# Altium schematic sheet HDMI.SchDoc
size C; SheetNumber: 6; SheetTotal: 9
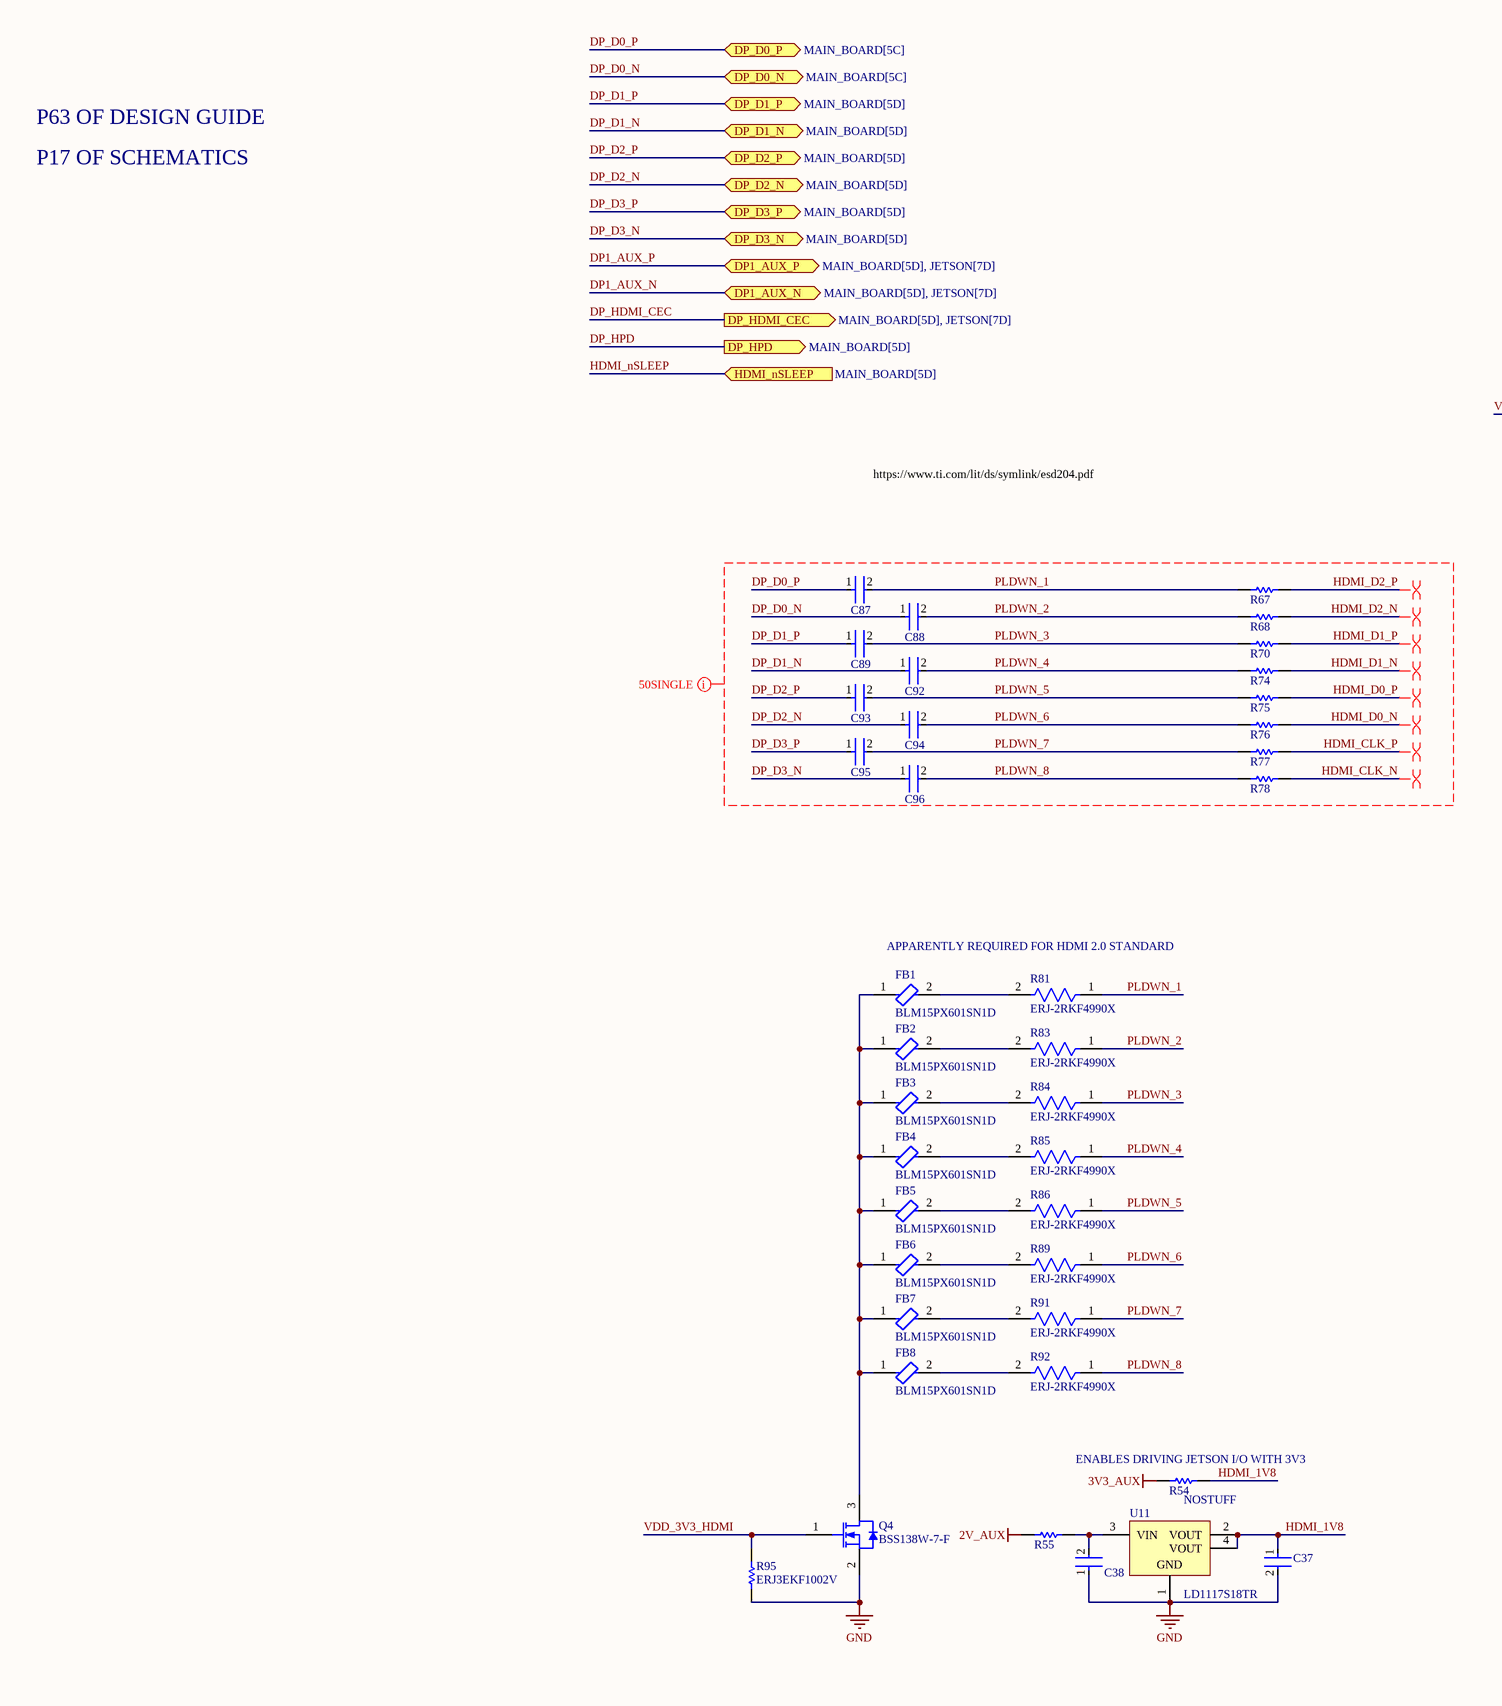
[diagram p0: HDMI.SchDoc, left]
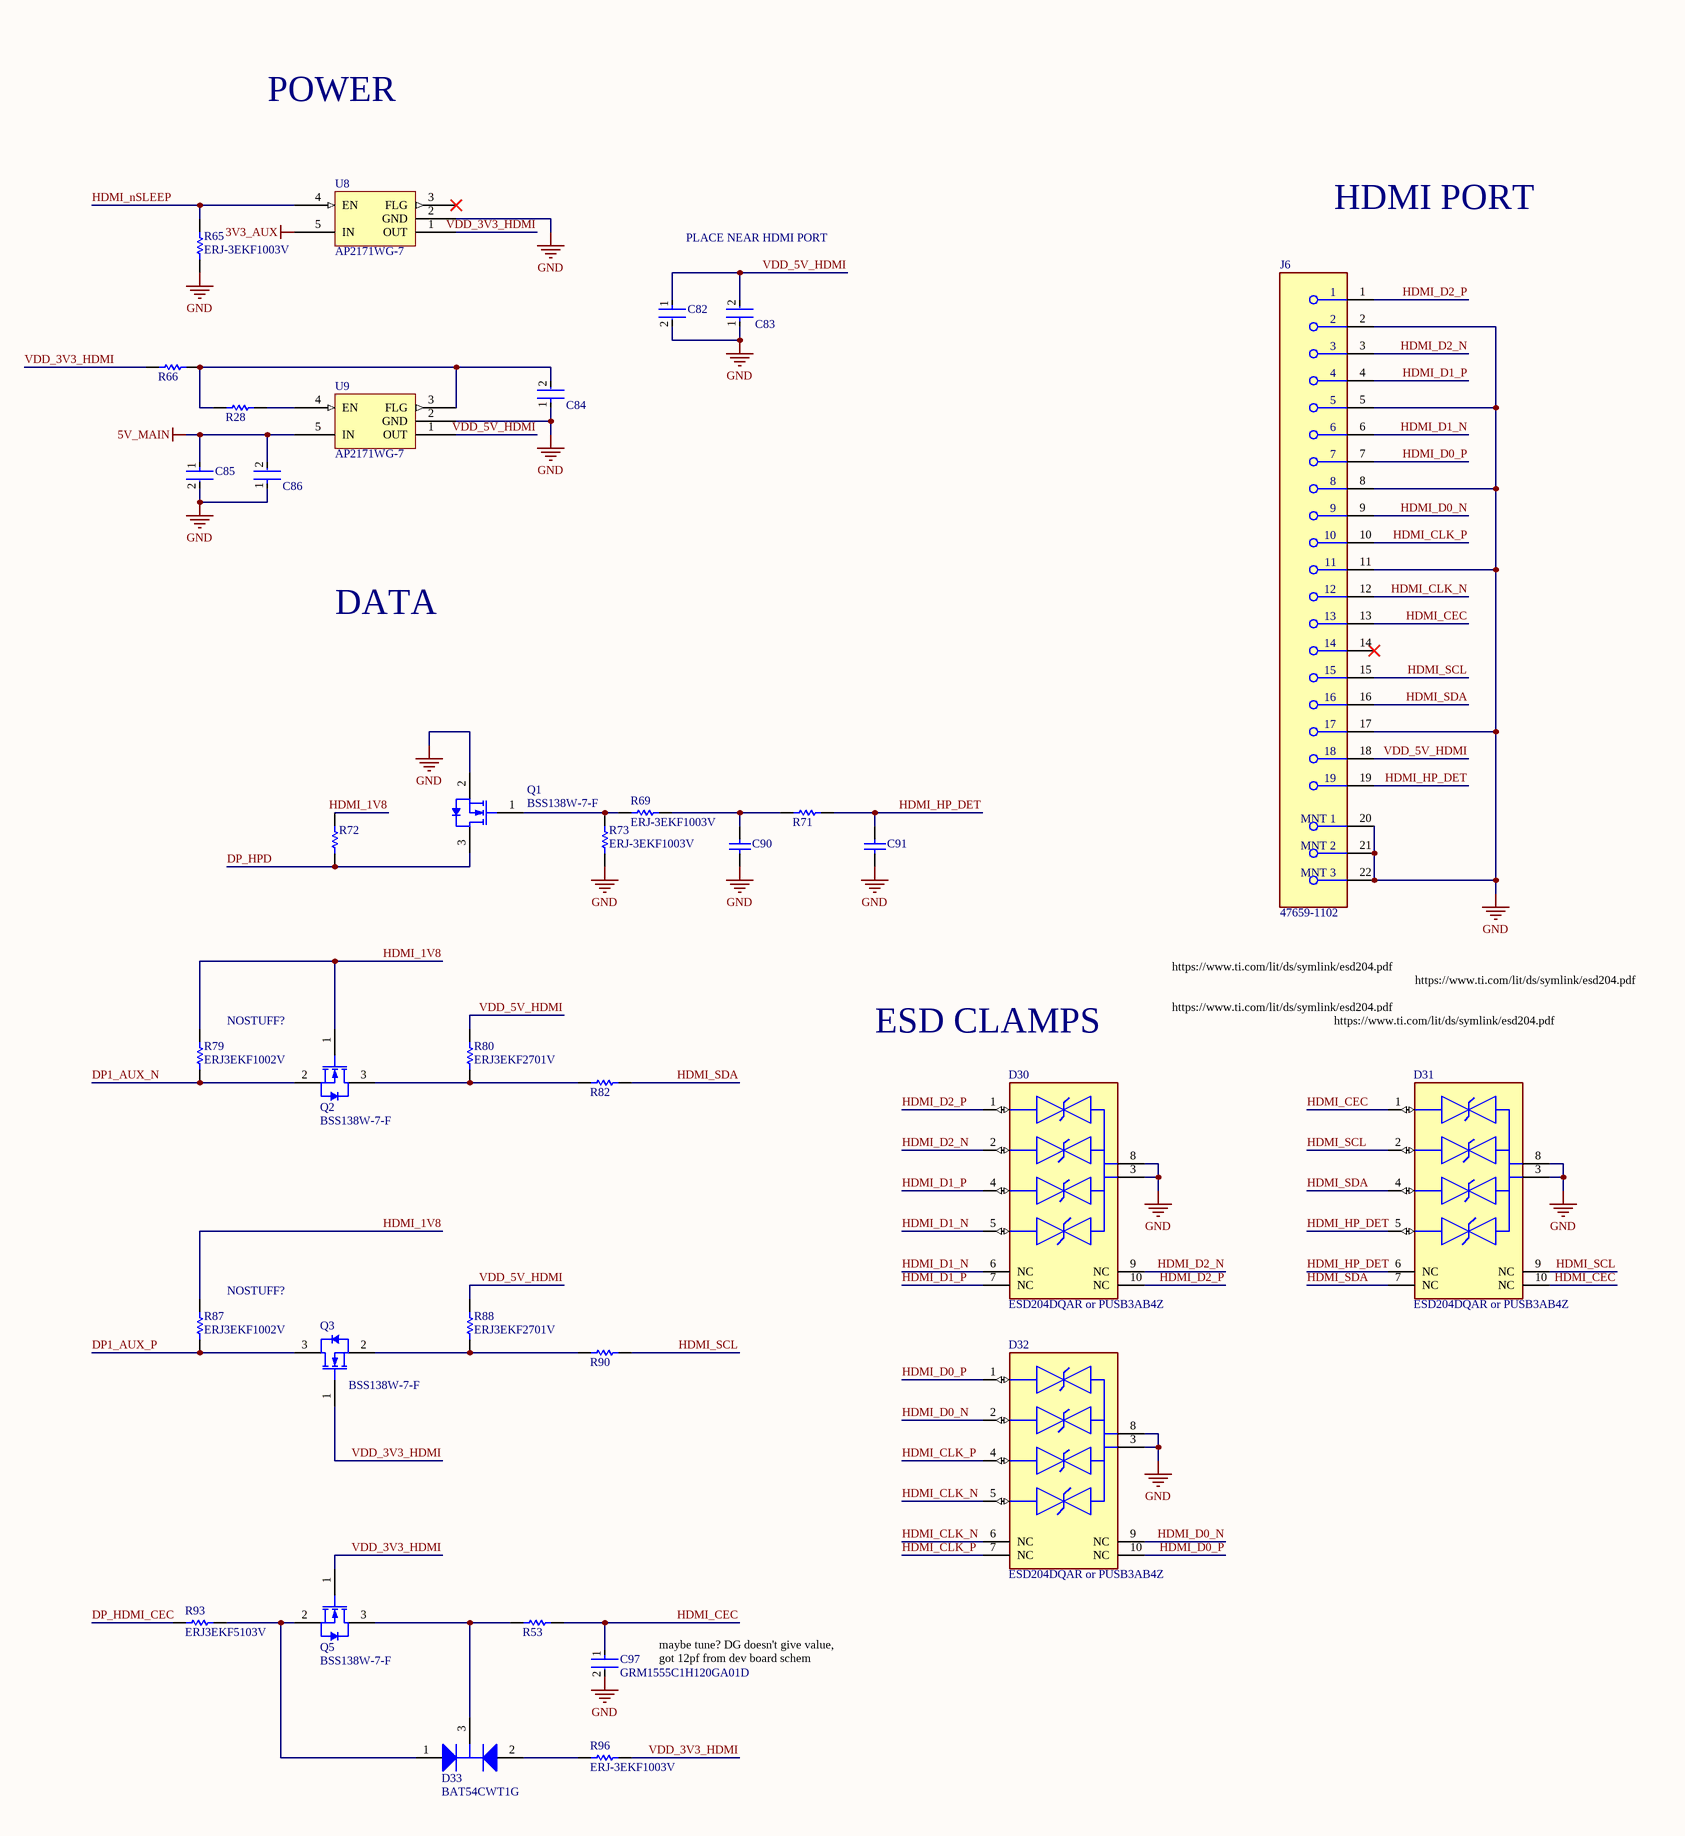
[diagram p1: HDMI.SchDoc, right]

## Parts
C37  GRM188R60J106ME47D  [FP-GRM188-0_1-e0_2_0_55-IPC_A]  (value not drawn)
C38  C1005X7R1H104K050BB  [FP-C1005-050-0_05-IPC_C]  (value not drawn)
C82  GRM188R60J106ME47D  [FP-GRM188-0_1-e0_2_0_55-IPC_A]  (value not drawn)
C83  C1005X7R1H104K050BB  [FP-C1005-050-0_05-IPC_C]  (value not drawn)
C84  C1005X7R1H104K050BB  [FP-C1005-050-0_05-IPC_C]  (value not drawn)
C85  GRM188R60J106ME47D  [FP-GRM188-0_1-e0_2_0_55-IPC_A]  (value not drawn)
C86  C1005X7R1H104K050BB  [FP-C1005-050-0_05-IPC_C]  (value not drawn)
C87  C1005X7R1H104K050BB  [FP-C1005-050-0_05-IPC_C]  (value not drawn)
C88  C1005X7R1H104K050BB  [FP-C1005-050-0_05-IPC_C]  (value not drawn)
C89  C1005X7R1H104K050BB  [FP-C1005-050-0_05-IPC_C]  (value not drawn)
C90  C0402C221K5RAC7867  [CAPC1005X60X30NL05T10]  (value not drawn)
C91  C0402C221K5RAC7867  [CAPC1005X60X30NL05T10]  (value not drawn)
C92  C1005X7R1H104K050BB  [FP-C1005-050-0_05-IPC_C]  (value not drawn)
C93  C1005X7R1H104K050BB  [FP-C1005-050-0_05-IPC_C]  (value not drawn)
C94  C1005X7R1H104K050BB  [FP-C1005-050-0_05-IPC_C]  (value not drawn)
C95  C1005X7R1H104K050BB  [FP-C1005-050-0_05-IPC_C]  (value not drawn)
C96  C1005X7R1H104K050BB  [FP-C1005-050-0_05-IPC_C]  (value not drawn)
C97  GRM1555C1H120GA01D  [FP-GRM155-0_05-MFG]
D30  ESD204DQAR or PUSB3AB4Z  [FP-DQA0010A-MFG]
D31  ESD204DQAR or PUSB3AB4Z  [FP-DQA0010A-MFG]
D32  ESD204DQAR or PUSB3AB4Z  [FP-DQA0010A-MFG]
D33  BAT54CWT1G  [ONSC-SOT-323-3-419-04_V]
FB1  BLM15PX601SN1D  [FP-BLM15-0_05-MFG]
FB2  BLM15PX601SN1D  [FP-BLM15-0_05-MFG]
FB3  BLM15PX601SN1D  [FP-BLM15-0_05-MFG]
FB4  BLM15PX601SN1D  [FP-BLM15-0_05-MFG]
FB5  BLM15PX601SN1D  [FP-BLM15-0_05-MFG]
FB6  BLM15PX601SN1D  [FP-BLM15-0_05-MFG]
FB7  BLM15PX601SN1D  [FP-BLM15-0_05-MFG]
FB8  BLM15PX601SN1D  [FP-BLM15-0_05-MFG]
J6  47659-1102  [FP-47659-1102-MFG]
Q1  BSS138W-7-F  [DIOD-SOT323-3_V]
Q2  BSS138W-7-F  [DIOD-SOT323-3_V]
Q3  BSS138W-7-F  [DIOD-SOT323-3_V]
Q4  BSS138W-7-F  [DIOD-SOT323-3_V]
Q5  BSS138W-7-F  [DIOD-SOT323-3_V]
R28  0402 JUMPER 0 OHM  [RESC1005X40X25NL05T05]  (value not drawn)
R53  0402 JUMPER 0 OHM  [RESC1005X40X25NL05T05]  (value not drawn)
R54  0402 JUMPER 0 OHM  [RESC1005X40X25NL05T05]  (value not drawn)
R55  0402 JUMPER 0 OHM  [RESC1005X40X25NL05T05]  (value not drawn)
R65  ERJ-3EKF1003V  [RESC1608X55X30ML15T15]
R66  ERJ3EKF1002V  [RESC1609X55X30LL15T15]  (value not drawn)
R67  0402 JUMPER 0 OHM  [RESC1005X40X25NL05T05]  (value not drawn)
R68  0402 JUMPER 0 OHM  [RESC1005X40X25NL05T05]  (value not drawn)
R69  ERJ-3EKF1003V  [RESC1608X55X30ML15T15]
R70  0402 JUMPER 0 OHM  [RESC1005X40X25NL05T05]  (value not drawn)
R71  0402 JUMPER 0 OHM  [RESC1005X40X25NL05T05]  (value not drawn)
R72  ERJ3EKF1002V  [RESC1609X55X30LL15T15]  (value not drawn)
R73  ERJ-3EKF1003V  [RESC1608X55X30ML15T15]
R74  0402 JUMPER 0 OHM  [RESC1005X40X25NL05T05]  (value not drawn)
R75  0402 JUMPER 0 OHM  [RESC1005X40X25NL05T05]  (value not drawn)
R76  0402 JUMPER 0 OHM  [RESC1005X40X25NL05T05]  (value not drawn)
R77  0402 JUMPER 0 OHM  [RESC1005X40X25NL05T05]  (value not drawn)
R78  0402 JUMPER 0 OHM  [RESC1005X40X25NL05T05]  (value not drawn)
R79  ERJ3EKF1002V  [RESC1609X55X30LL15T15]
R80  ERJ3EKF2701V  [RESC1608X55X30LL15T15]
R81  ERJ-2RKF4990X  [FP-ERJ2RK-MFG]
R82  0402 JUMPER 0 OHM  [RESC1005X40X25NL05T05]  (value not drawn)
R83  ERJ-2RKF4990X  [FP-ERJ2RK-MFG]
R84  ERJ-2RKF4990X  [FP-ERJ2RK-MFG]
R85  ERJ-2RKF4990X  [FP-ERJ2RK-MFG]
R86  ERJ-2RKF4990X  [FP-ERJ2RK-MFG]
R87  ERJ3EKF1002V  [RESC1609X55X30LL15T15]
R88  ERJ3EKF2701V  [RESC1608X55X30LL15T15]
R89  ERJ-2RKF4990X  [FP-ERJ2RK-MFG]
R90  0402 JUMPER 0 OHM  [RESC1005X40X25NL05T05]  (value not drawn)
R91  ERJ-2RKF4990X  [FP-ERJ2RK-MFG]
R92  ERJ-2RKF4990X  [FP-ERJ2RK-MFG]
R93  ERJ3EKF5103V  [RESC1608X55X30LL15T15]
R95  ERJ3EKF1002V  [RESC1609X55X30LL15T15]
R96  ERJ-3EKF1003V  [RESC1608X55X30ML15T15]
U8  AP2171WG-7  [SOT95P285X130-5N]
U9  AP2171WG-7  [SOT95P285X130-5N]
U11  LD1117S18TR  [SOT-223_M]

## Ports
DP1_AUX_N (bidir, see MAIN_BOARD[5D], JETSON[7D]), DP1_AUX_P (bidir, see MAIN_BOARD[5D], JETSON[7D]), DP_D0_N (bidir, see MAIN_BOARD[5C]), DP_D0_P (bidir, see MAIN_BOARD[5C]), DP_D1_N (bidir, see MAIN_BOARD[5D]), DP_D1_P (bidir, see MAIN_BOARD[5D]), DP_D2_N (bidir, see MAIN_BOARD[5D]), DP_D2_P (bidir, see MAIN_BOARD[5D]), DP_D3_N (bidir, see MAIN_BOARD[5D]), DP_D3_P (bidir, see MAIN_BOARD[5D]), DP_HDMI_CEC (out, see MAIN_BOARD[5D], JETSON[7D]), DP_HPD (out, see MAIN_BOARD[5D]), HDMI_nSLEEP (in, see MAIN_BOARD[5D])

## Nets
2V_AUX: R55.1
3V3_AUX: R54.1 U8.5(IN)
5V_MAIN: C85.1 C86.2 U9.5(IN)
GND: C37.2 C38.1 C82.2 C83.1 C84.1 C85.2 C86.1 C90.1 C91.1 C97.2 D30.3(GND) D30.8(GND) D31.3(GND) D31.8(GND) D32.3(GND) D32.8(GND) J6.2 J6.5 J6.8 J6.11 J6.17 J6.20(MNT_1) J6.21(MNT_2) J6.22(MNT_3) Q1.2(S) Q4.2(S) R65.1 R73.1 R95.1 U8.2(GND) U9.2(GND) U11.1(GND)
DP1_AUX_N: Q2.2(S) R79.1 ; port DP1_AUX_N
DP1_AUX_P: Q3.3(D) R87.1 ; port DP1_AUX_P
DP_D0_N: C88.1 ; port DP_D0_N
DP_D0_P: C87.1 ; port DP_D0_P
DP_D1_N: C92.1 ; port DP_D1_N
DP_D1_P: C89.1 ; port DP_D1_P
DP_D2_N: C94.1 ; port DP_D2_N
DP_D2_P: C93.1 ; port DP_D2_P
DP_D3_N: C96.1 ; port DP_D3_N
DP_D3_P: C95.1 ; port DP_D3_P
DP_HDMI_CEC: R93.1 ; port DP_HDMI_CEC
DP_HPD: Q1.3(D) R72.1 ; port DP_HPD
HDMI_1V8: C37.1 Q2.1(G) R54.2 R72.2 R79.2 R87.2 U11.2(VOUT) U11.4(VOUT)
HDMI_CEC: C97.1 D31.1(IO1) D31.10(NC) J6.13 R53.2
HDMI_CLK_N: D32.5(IO4) D32.6(NC) J6.12 R78.2
HDMI_CLK_P: D32.4(IO3) D32.7(NC) J6.10 R77.2
HDMI_D0_N: D32.2(IO2) D32.9(NC) J6.9 R76.2
HDMI_D0_P: D32.1(IO1) D32.10(NC) J6.7 R75.2
HDMI_D1_N: D30.5(IO4) D30.6(NC) J6.6 R74.2
HDMI_D1_P: D30.4(IO3) D30.7(NC) J6.4 R70.2
HDMI_D2_N: D30.2(IO2) D30.9(NC) J6.3 R68.2
HDMI_D2_P: D30.1(IO1) D30.10(NC) J6.1 R67.2
HDMI_HP_DET: C91.2 D31.5(IO4) D31.6(NC) J6.19 R71.2
HDMI_nSLEEP: R65.2 U8.4(EN) ; port HDMI_nSLEEP
HDMI_SCL: D31.2(IO2) D31.9(NC) J6.15 R90.2
HDMI_SDA: D31.4(IO3) D31.7(NC) J6.16 R82.2
PLDWN_1: C87.2 R67.1 R81.1
PLDWN_2: C88.2 R68.1 R83.1
PLDWN_3: C89.2 R70.1 R84.1
PLDWN_4: C92.2 R74.1 R85.1
PLDWN_5: C93.2 R75.1 R86.1
PLDWN_6: C94.2 R76.1 R89.1
PLDWN_7: C95.2 R77.1 R91.1
PLDWN_8: C96.2 R78.1 R92.1
VDD_3V3_HDMI: Q3.1(G) Q4.1(G) Q5.1(G) R66.2 R95.2 R96.2 U8.1(OUT)
VDD_5V_HDMI: C82.1 C83.2 J6.18 R80.2 R88.2 U9.1(OUT)
NetC38_2: C38.2 R55.2 U11.3(VIN)
NetC84_2: C84.2 R28.1 R66.1 U9.3(FLG)
NetC90_2: C90.2 R69.2 R71.1
NetD33_1: D33.1(A1) Q5.2(S) R93.2
NetD33_2: D33.2(A2) R96.1
NetD33_3: D33.3(K) Q5.3(D) R53.1
NetFB1_1: FB1.1 FB2.1 FB3.1 FB4.1 FB5.1 FB6.1 FB7.1 FB8.1 Q4.3(D)
NetFB1_2: FB1.2 R81.2
NetFB2_2: FB2.2 R83.2
NetFB3_2: FB3.2 R84.2
NetFB4_2: FB4.2 R85.2
NetFB5_2: FB5.2 R86.2
NetFB6_2: FB6.2 R89.2
NetFB7_2: FB7.2 R91.2
NetFB8_2: FB8.2 R92.2
NetQ1_1: Q1.1(G) R69.1 R73.2
NetQ2_3: Q2.3(D) R80.1 R82.1
NetQ3_2: Q3.2(S) R88.1 R90.1
NetR28_2: R28.2 U9.4(EN)

Not connected (* = marked no-connect by the designer): J6 14*; U8 3(FLG)*

## Layout directives
differential pair; differential pair class 100DIFF: HDMI_CLK_N, HDMI_CLK_P, HDMI_D0_N, HDMI_D0_P, HDMI_D1_N, HDMI_D1_P, HDMI_D2_N, HDMI_D2_P
net class 50SINGLE: DP_D0_N, DP_D0_P, DP_D1_N, DP_D1_P, DP_D2_N, DP_D2_P, DP_D3_N, DP_D3_P, HDMI_CLK_N, HDMI_CLK_P, HDMI_D0_N, HDMI_D0_P, HDMI_D1_N, HDMI_D1_P, HDMI_D2_N, HDMI_D2_P, PLDWN_1, PLDWN_2, PLDWN_3, PLDWN_4, PLDWN_5, PLDWN_6, PLDWN_7, PLDWN_8

## Notes on the sheet
- P63 OF DESIGN GUIDE
- P17 OF SCHEMATICS
- POWER
- HDMI PORT
- PLACE NEAR HDMI PORT
- https://www.ti.com/lit/ds/symlink/esd204.pdf
- DATA
- APPARENTLY REQUIRED FOR HDMI 2.0 STANDARD
- (near R79) NOSTUFF?
- ESD CLAMPS
- (near R87) NOSTUFF?
- (near R54) ENABLES DRIVING JETSON I/O WITH 3V3
- (near R54) NOSTUFF
- maybe tune? DG doesn't give value, got 12pf from dev board schem

## Library data of the parts
C37 C82 C85 = CMP-2006-02792-2: Chip Multilayer Ceramic Capacitors for General Purpose, 0603, 10uF, X5R, 15%, 20%, 6.3V; Packaging: Tape and Reel; Voltage Rating (DC): 6.3V; Width: 0.031inch; Termination: SMD/SMT; Dielectric: X5R; Package Quantity: 4000; Voltage Rating: 6.3V; Capacitance: 10uF; Case/Package: 0603; Min Operating Temperature: -55°C; Voltage: 6.3V; Length: 1.6mm; Thickness: 0.035inch; Lead Free: Lead Free; Depth: 0.8mm; Case Code (Imperial): 0603; Max Operating Temperature: 85°C; Material: Ceramic; Height: 0.8mm; Tolerance: 20%; Mount: Surface Mount; REACH SVHC: No SVHC; Radiation Hardening: No; Case Code (Metric): 1608
C38 C83 C84 C86-C89 C92-C96 = CMP-2000-05393-2: Multilayer Ceramic Capacitors 100nF ±10% 50V X7R SMD 0402; Voltage: 50V; Dielectric Material: Ceramic; Min Operating Temperature: -55°C; Depth: 0.5mm; Radiation Hardening: No; RoHS Compliant: Yes; Voltage Rating (DC): 50V; Lead Free: Lead Free; Resistor Type: Ceramic; Height: 0.5mm; Dielectric: X7R; Thickness: 0.022inch; Case/Package: 0402; Case Code (Metric): 1005; Termination: SMD/SMT; Capacitance: 100nF; Packaging: Tape and Reel; Max Operating Temperature: 125°C; Mount: Surface Mount; Package Quantity: 1; Width: 0.02inch; Weight: 2.3E-05oz; Voltage Rating: 50V; Tolerance: 10%; Construction: Flat; Case Code (Imperial): 0402; Length: 1mm; REACH SVHC: No SVHC; Series: C
C90 C91 = CMP-2008-03137-2: Manufacturer: Kemet; Part Number: C0402C221K5RAC7867
C97 = CMP-2008-03945-2: CAP CER 12PF 50V C0G/NP0 0402; Tolerance: 2%; Dielectric: C0G; Material: Ceramic; Termination: SMD/SMT; Mount: Surface Mount; REACH SVHC: No SVHC; Depth: 0.5mm; Case Code (Metric): 1005; Voltage Rating: 50V; Height: 0.5mm; Voltage Rating (DC): 50V; Case Code (Imperial): 0402; Package Quantity: 10000; Construction: Flat; Thickness: 0.022inch; Length: 1mm; Min Operating Temperature: -55°C; Width: 0.5mm; Lead Free: Lead Free; Capacitance: 12pF; Case/Package: 0402; Packaging: Tape and Reel; Series: GRM; Voltage: 50V; Radiation Hardening: No; Max Operating Temperature: 125°C
D30-D32 = CMP-04989-000002-1: 4-CHANNEL LOW-CAPACITANCE SURGE; Manufacturer: Texas Instruments; Value: 0.55pF; Reverse Standoff Voltage: 3.6V; Standoff Height: 0mm; Breakdown Voltage: 5.5V; Peak Pulse Current: 5.5A; Clamping Voltage: 11.5V; Direction: Bidirectional; Peak Pulse Power: 50W; Number Of Channels: 4; Ambient Temperature Range High: +125°C; ComponentLink2Description: Datasheet; Height: 0.55mm; Lead Free: Yes; Device Class L3: unset; Temperature Range High: +125°C; Temperature Range Low: -40°C; Package: DQA0010A; Temperature: -40°C to +125°C; Capacitance: 0.55pF; RoHS: TRUE; Mouser Description: 4-Channel Low-Capacitance Surge and ESD Protection Diode 10-USON -40 to 125; Category: Diode; Device Class L1: Circuit Protection; Octopart: https://octopart.com/esd204dqar-texas+instruments-89917476; Device Class L2: TVS Diodes; Ambient Temperature Range Low: -40°C; Manufacturer Part Number: ESD204DQAR; ComponentLink2URL: http://www.ti.com/lit/ds/symlink/esd204.pdf; Automotive: No; Digikey Description: 4-CHANNEL LOW-CAPACITANCE SURGE
D33 = CMP-1055-00557-1: Dual Series Cathode Schottky Barrier Diodes, 3-Pin SOT-323, Pb-Free, Tape and Reel; Manufacturer: On Semiconductor; Configuration: Common Cathode; IFSM Max (A): 0.6; trr Max (ns): 5; ComponentLink2Description: Datasheet; Packing: Tape and Reel; ComponentLink3Description: Package Specification; Mounting Technology: Surface Mount; PartNumber: BAT54CWT1G; PackageVersion: Rev. N, 11/2008; RoHS: TRUE; ComponentLink3URL: http://www.onsemi.com/pub_link/Collateral/419-04.PDF; ComponentLink2URL: http://www.onsemi.cn/pub_link/Collateral/BAT54CWT1-D.PDF; PackageReference: SOT-323-3-419-04; ComponentLink1URL: http://www.onsemi.com/; ComponentLink1Description: Manufacturer URL; DatasheetVersion: Rev. 7; PackageDescription: 3-Pin Small Outline Transistor, Body 2 x 1.25 mm, Pitch 0.65 mm
FB1-FB8 = CMP-0686-00252-4: Chip Ferrite Bead, 0402, 600Ω @ 100MHz, 0.23Ω, 25%, 900mA; Number of Circuits: 1; Impedance: 600R; DC Resistance (DCR): 230mR; Material: Steel; Length: 1mm; Package Quantity: 10000; Height: 0.5mm; Width: 0.5mm; Max DC Current: 900mA; Number of Lines: 1; Termination: SMD/SMT; Packaging: Tape and Reel; Lead Free: Lead Free; Min Operating Temperature: -55°C; Max Operating Temperature: 125°C; Max Current Rating: 900mA; Case Code (Imperial): 0402; Number of Pins: 2; Current Rating: 900mA; Test Frequency: 100MHz; Case/Package: 0402; Tolerance: 25%; Case Code (Metric): 1005
J6 = CMP-04768-000010-1: HDMI REC.VERTICAL SMT TYPE W/HEI; RoHS Compliant: Yes
Q1-Q5 = CMP-2000-05968-1: N-Channel Enhancement Mode Mosfet, 50 V, 200 mA, -55 to 150 degC, 6-Pin SOT-323, RoHS, Tape and Reel; Typical Turn-Off Delay Time: 20ns; Number of Channels: 1Channel; Type: EnhancementModeFieldEffectTransistor; Brand: DiodesIncorporated; Vds - Drain-Source Breakdown Voltage: 75V; Vgs - Gate-Source Voltage: 20V; Rds On - Drain-Source Resistance: 1.4Ohms; Transistor Type: 1N-Channel; Configuration: Single; Unit Weight: 0.000212oz; Pd - Power Dissipation: 200mW; Id - Continuous Drain Current: 200mA; Forward Transconductance - Min: 0.1S; Manufacturer URL: http://www.diodes.com/; Series: BSS138; Package Description: 3-Pin Small Outline Transistor, Body 2 x 1.25 mm, Pitch 0.65 mm; Mounting Technology: SurfaceMount; Product Category: MOSFET; RoHS: True; Maximum Operating Temperature: +150C; Height: 1mm; Length: 2.2mm; Technology: Si; Width: 1.35mm; Datasheet URL: http://www.diodes.com/_files/datasheets/ds30206.pdf; Manufacturer: DiodesIncorporated; Package / Case: SOT-323-3; Typical Turn-On Delay Time: 20ns; Transistor Polarity: N-Channel; Factory Pack Quantity: 3000; Packaging: Reel; Product: MOSFETSmallSignal; Datasheet Version: Rev. 11-2, 09/2013; Package Reference: SOT323; Minimum Operating Temperature: -55C; Mounting Style: SMD/SMT; Channel Mode: Enhancement
R28 R53-R55 R67 R68 R70 R71 R74-R78 R82 R90 = CMP-009-00206-2: READ THE NAME
R65 R69 R73 R96 = CMP-2000-00182-1: Manufacturer: Panasonic; Part Number: ERJ-3EKF1003V
R66 R72 R79 R87 R95 = CMP-1012-00623-3: Chip Resistor, 10 KOhm, +/- 1%, 0.1 W, -55 to 155 degC, 0603 (1608 Metric), RoHS, Tape and Reel; Manufacturer: Panasonic; Voltage Rating: 75V; Case\/Package: 0603; Power Rating: 100mW; Resistance: 10KOhm; Temperature Coefficient: 100ppm\/degreesC; Number of Pins: 2; Package Reference: 603; Depth: 0.8mm; Mount: SurfaceMount; Package Description: 2-Pin Surface Mount Device, Body 1.6 x 0.85 mm; Datasheet Version: 02/2017; Length: 1.6mm; Lead Free: LeadFree; Height: 0.45mm; Number of Terminations: 2; Max Power Dissipation: 100mW; Min Operating Temperature: -55degC; Datasheet URL: https://industrial.panasonic.com/cdbs/www-data/pdf/RDA0000/AOA0000C304.pdf; Termination: SMD/SMT; Case Code (Metric): 1608; Case Code (Imperial): 0603; Tolerance: 1%; Max Operating Temperature: 155degC; RoHSCompliant: true; Voltage Rating (DC): 75V; Radiation Hardening: No; Packaging: TapeandReel; Composition: ThickFilm; Mounting Technology: SurfaceMount; Manufacturer URL: http://www.panasonic.com/; Width: 0.031inch; REACH SVHC: NoSVHC; Contact Plating: Tin; Military Standard: Not; Package Quantity: 1
R80 R88 = CMP-2000-00389-1: Manufacturer: Panasonic; Part Number: ERJ3EKF2701V
R81 R83-R86 R89 R91 R92 = CMP-2002-00965-2: RES SMD 499 OHM 1% 1/10W 0402; Temperature Coefficient: 100ppm/°C; Max Power Dissipation: 100mW; Voltage Rating (DC): 50V; Resistance: 499R; Technology: THICK FILM; Min Operating Temperature: -55°C; Package Quantity: 1; Width: 0.02inch; Contact Plating: Tin; Tolerance: 1%; Features: Automotive AEC-Q200; Resistance Tolerance: 1%; Size Code: 0402; Military Standard: Not; Resistor Type: Thick Film; Case/Package: 0402; Mount: Surface Mount; Case Code (Metric): 1005; RoHS Compliant: Yes; REACH SVHC: No SVHC; Number of Terminations: 2; Construction: Rectangular; Packaging: Tape and Reel; Series: ERJ; Lead Free: Lead Free; Length: 1mm; Voltage Rating: 50V; Termination: SMD/SMT; Max Operating Temperature: 155°C; Case Code (Imperial): 0402; Height: 0.35mm; Power Rating: 100mW; Depth: 0.5mm
R93 = CMP-2000-00542-1: Manufacturer: Panasonic; Part Number: ERJ3EKF5103V
U8 U9 = CMP-019-00057-1: IC PWR SW USB 1CH 1A SOT-25-5
U11 = CMP-0244-00308-1: Fixed Low Drop Positive Voltage Regulator, 1.8V, 4-Pin SOT-223, Tape and Reel; ComponentLink1URL: http://www.st.com; PackageReference: SOT-223; PackageDescription: 4-Pin SOT-223 Package, 6.5 x 3.5 mm Body, 2.3 mm Pitch, 7 mm Lead Span; ComponentLink2URL: http://www.st.com/internet/com/TECHNICAL_RESOURCES/TECHNICAL_LITERATURE/DATASHEET/CD00000544.pdf; ComponentLink2Description: Datasheet; ComponentLink1Description: Manufacturer URL; DatasheetVersion: 1/11/2011; PackageVersion: 2010